# EAGLE design neuron (EAGLE 9.6.2)
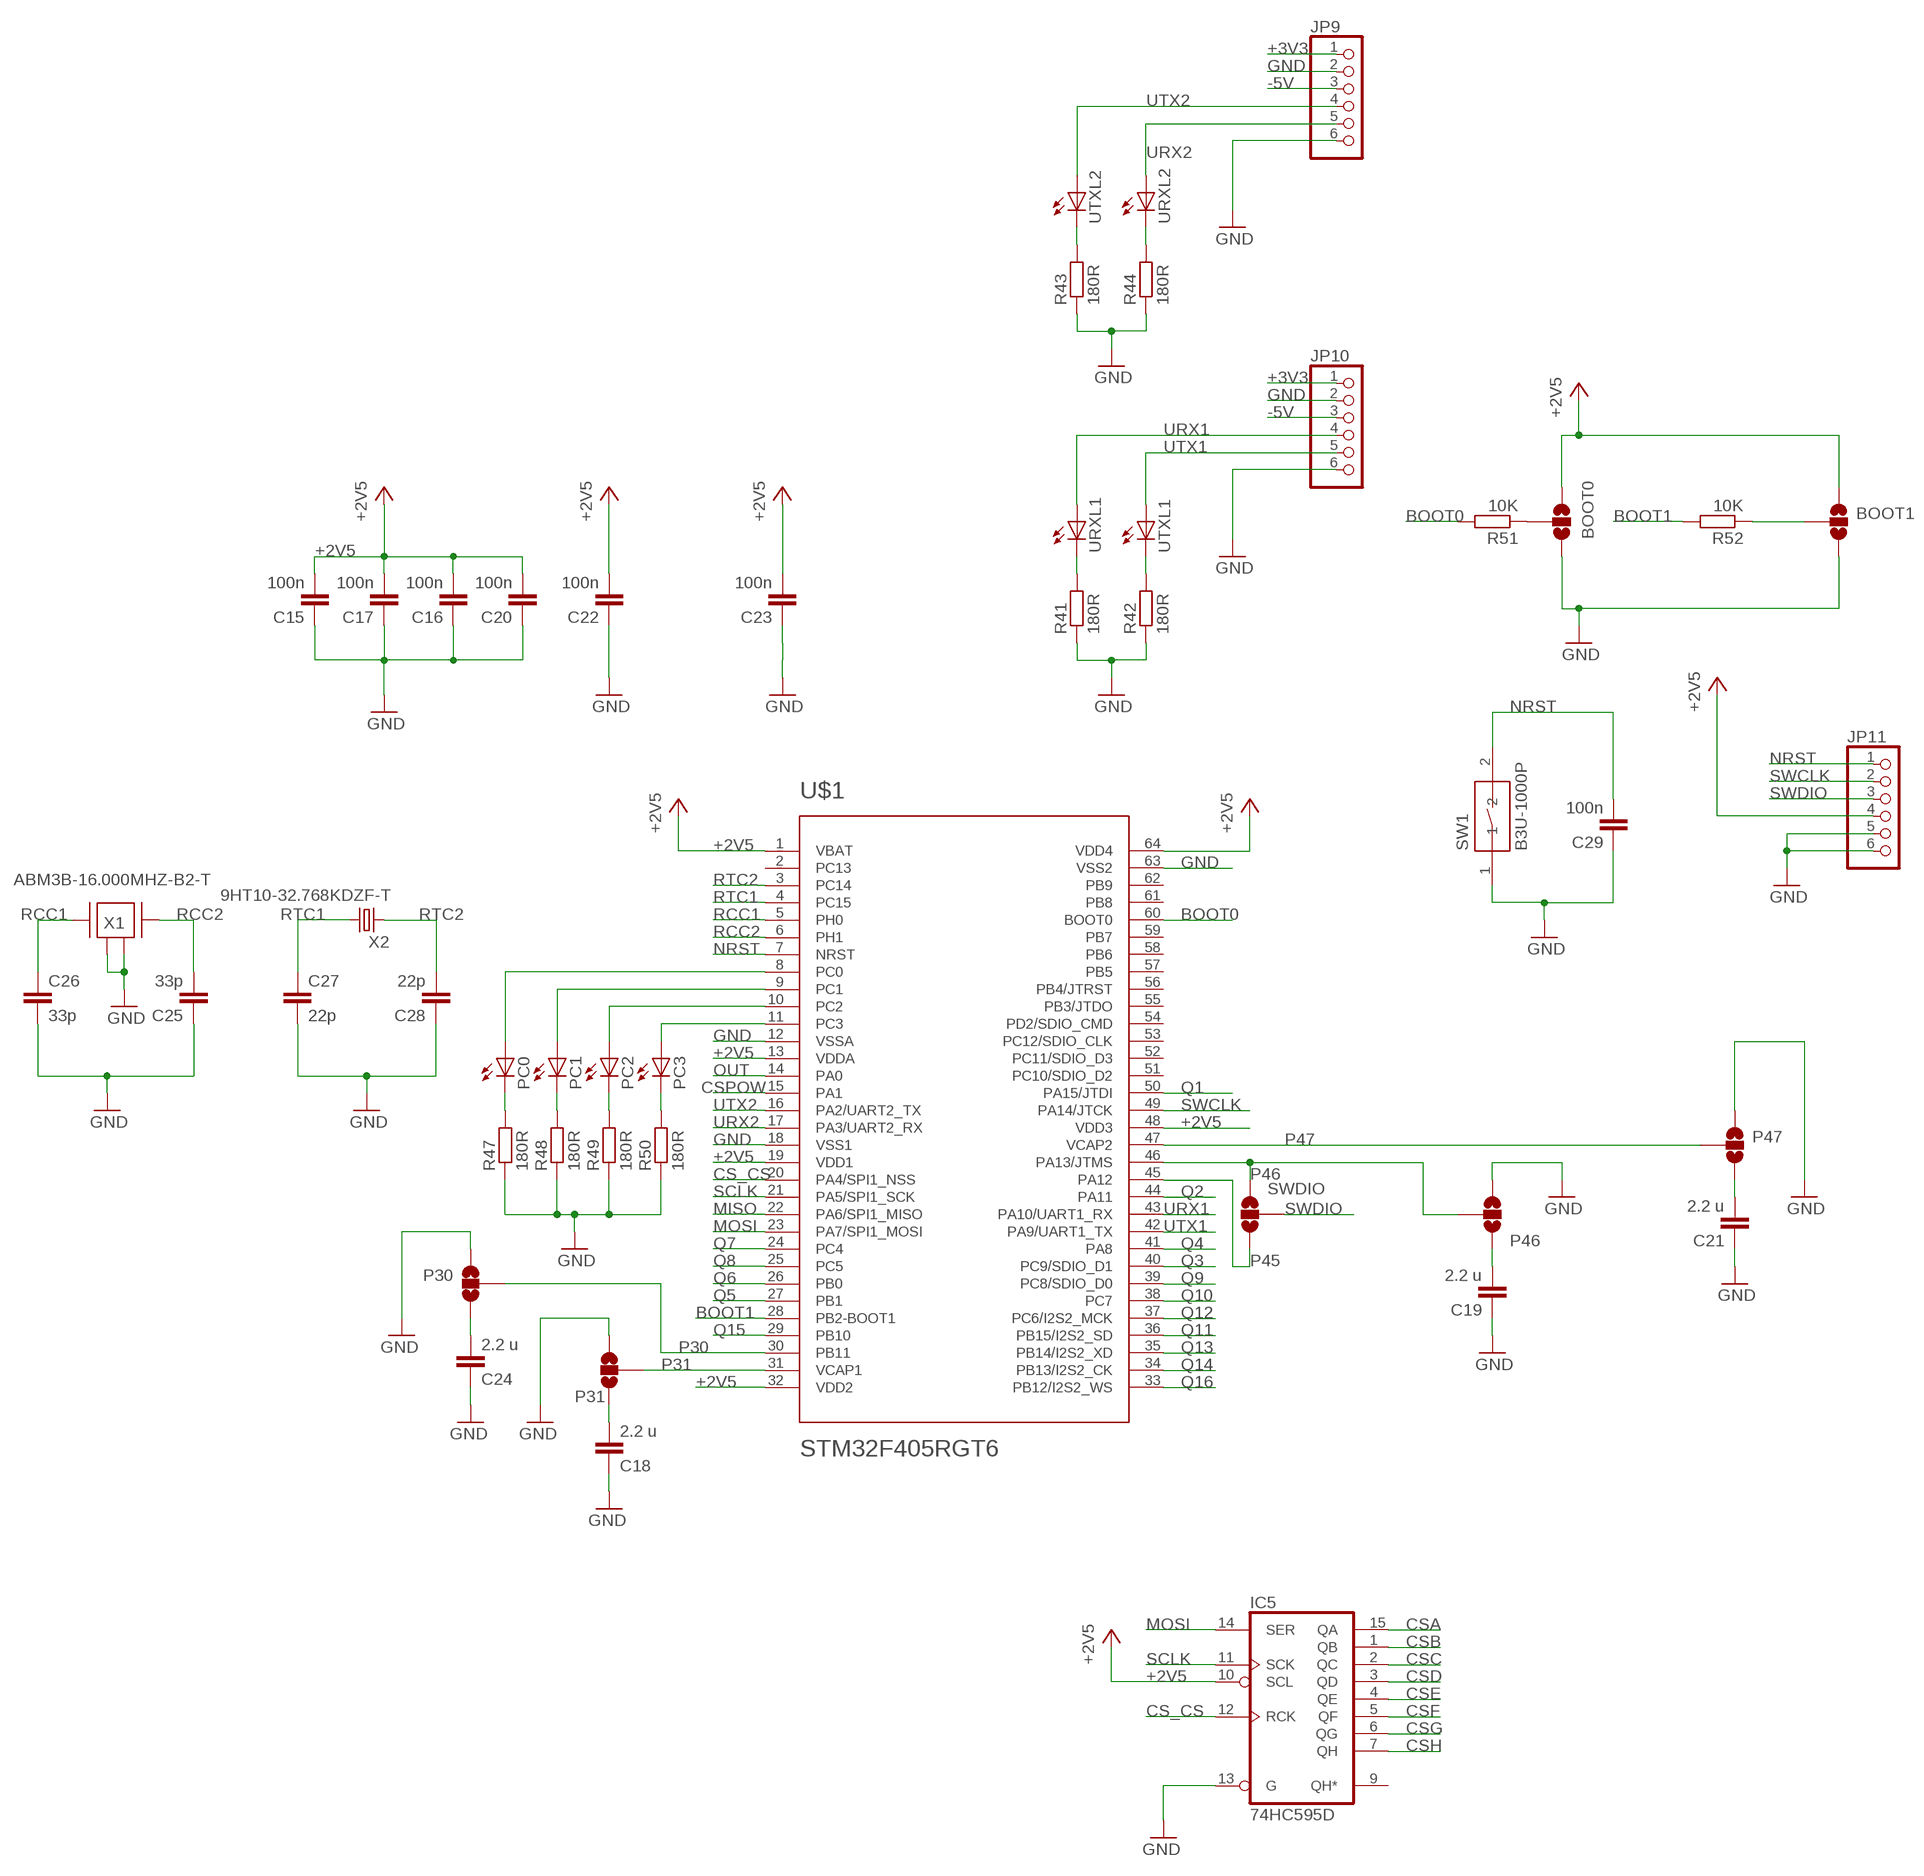
[diagram p0: schematic, sheet 1, part 1 of 2]
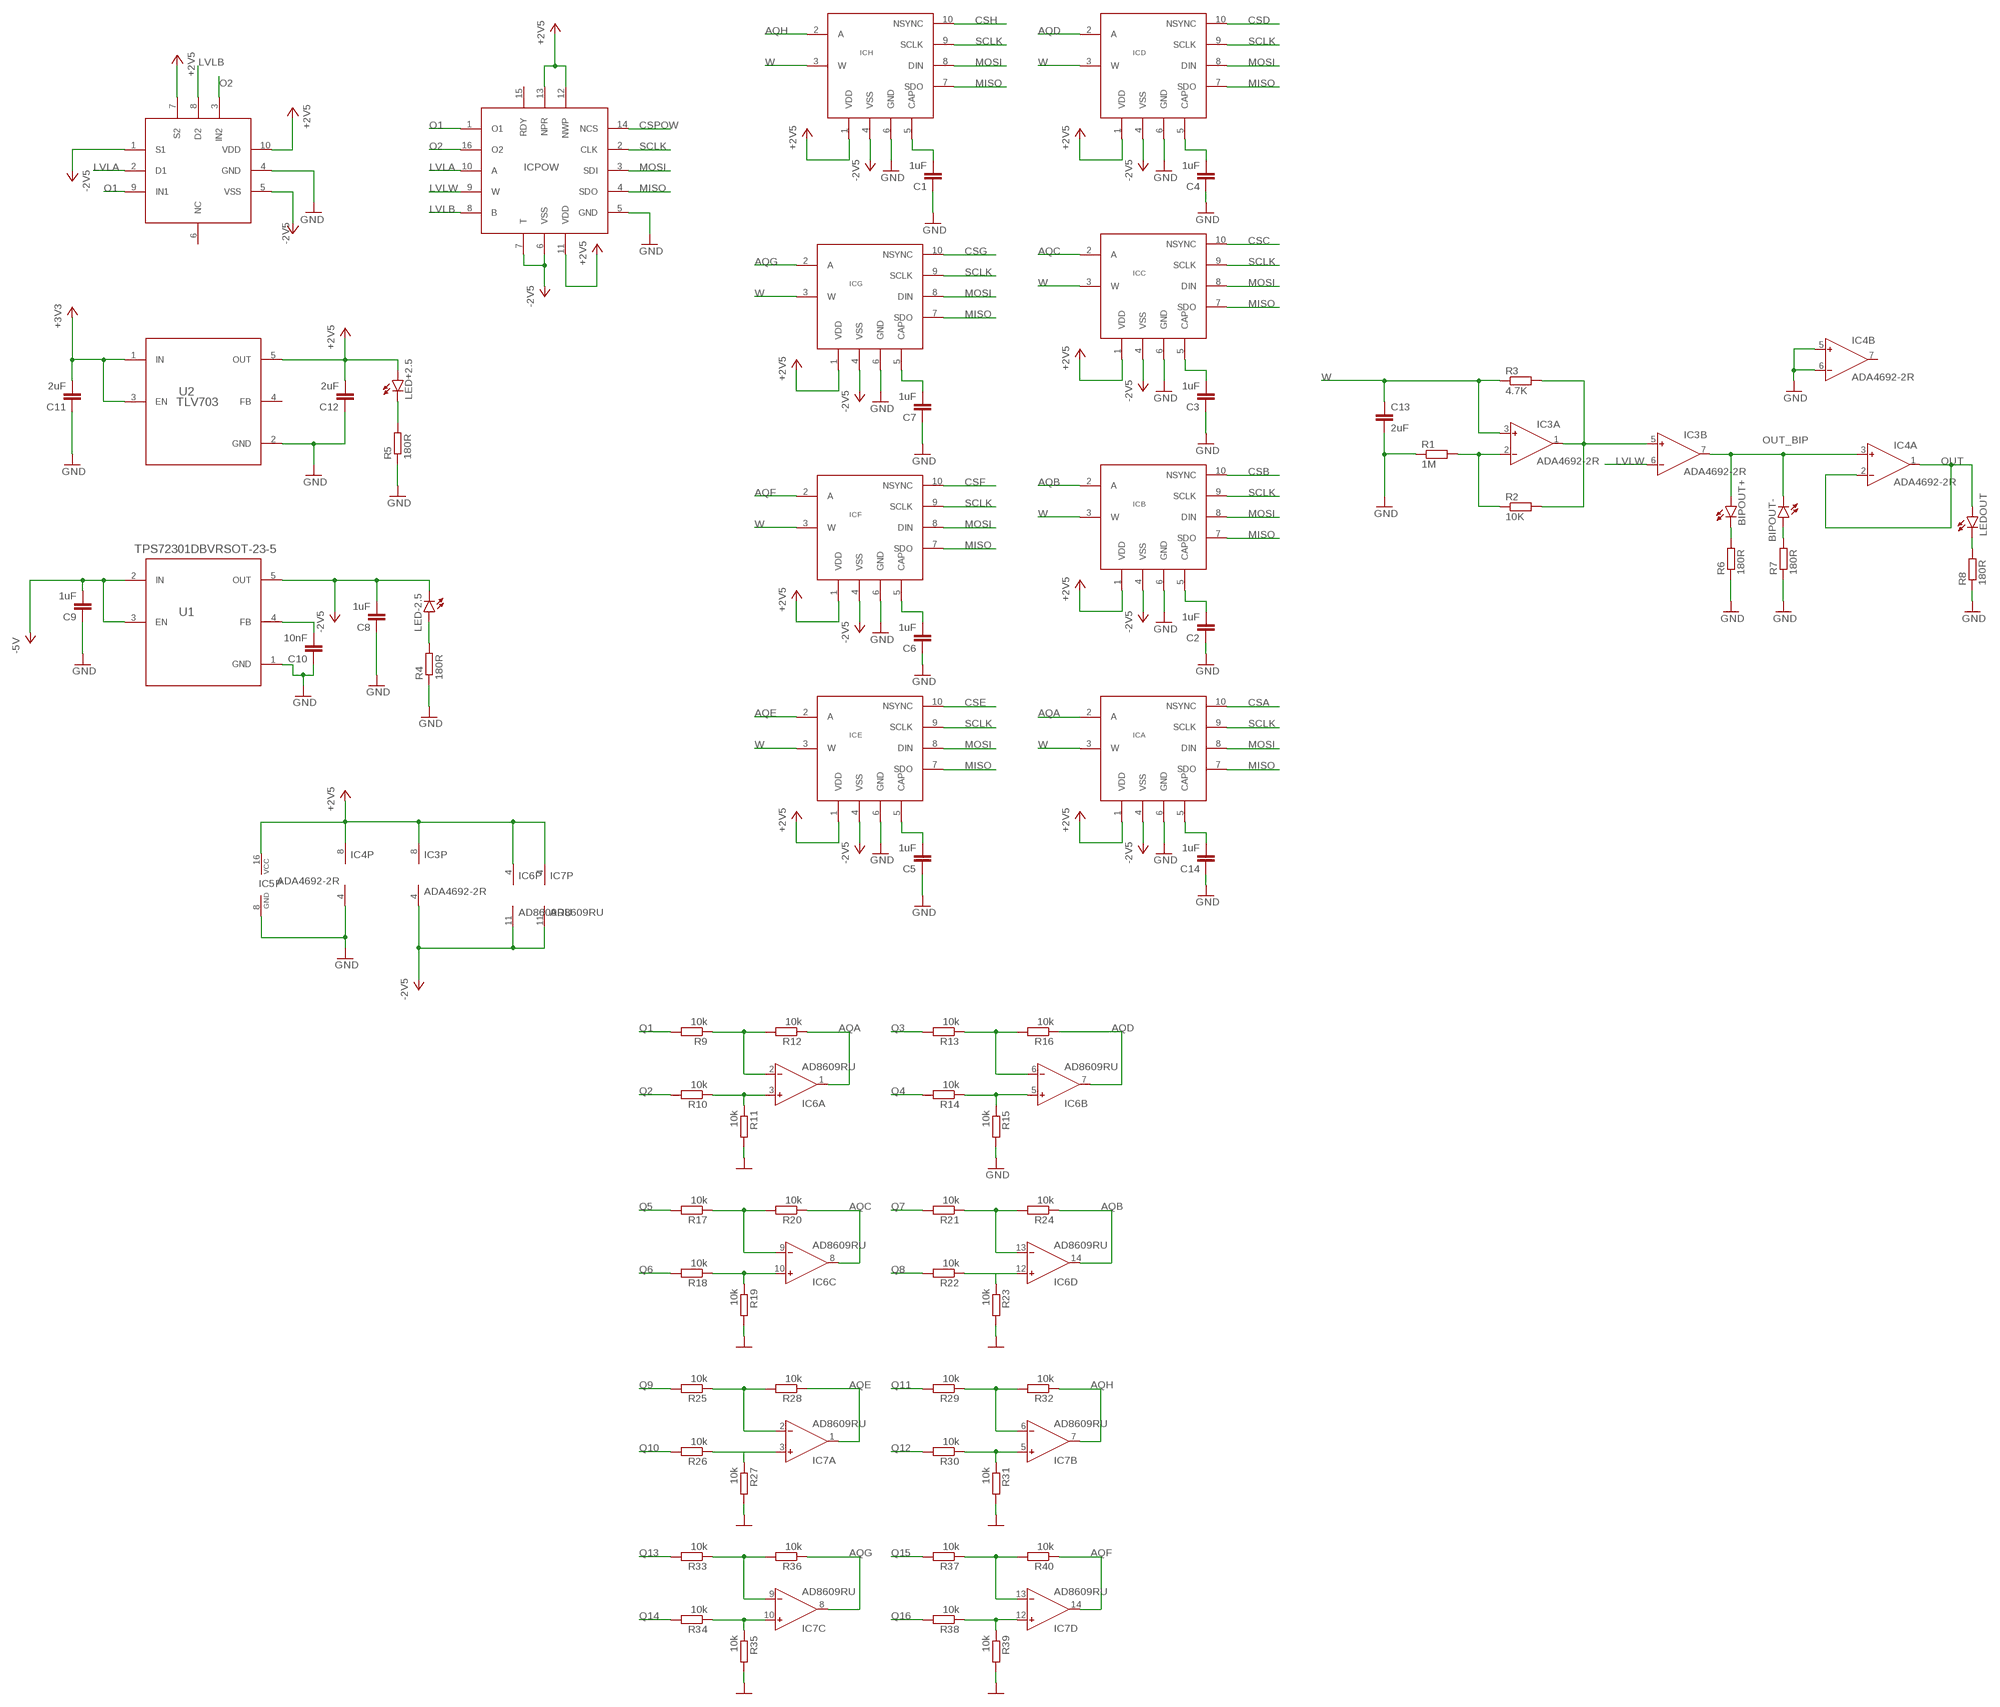
[diagram p1: schematic, sheet 1, part 2 of 2]

## Parts
BIPOUT+  LEDCHIPLED_0805  [CHIPLED_0805]
BIPOUT-  LEDCHIPLED_0805  [CHIPLED_0805]
BOOT0  JUMPER-SMT_3_NO_NO-SILK  [SMT-JUMPER_3_NO_NO-SILK]
BOOT1  JUMPER-SMT_3_NO_NO-SILK  [SMT-JUMPER_3_NO_NO-SILK]
C1  1uF  C-EUC0603  [C0603]
C2  1uF  C-EUC0603  [C0603]
C3  1uF  C-EUC0603  [C0603]
C4  1uF  C-EUC0603  [C0603]
C5  1uF  C-EUC0603  [C0603]
C6  1uF  C-EUC0603  [C0603]
C7  1uF  C-EUC0603  [C0603]
C8  1uF  C-EUC0603  [C0603]
C9  1uF  C-EUC0603  [C0603]
C10  10nF  C-EUC0603  [C0603]
C11  2uF  C-EUC0603  [C0603]
C12  2uF  C-EUC0603  [C0603]
C13  2uF  C-EUC0603K  [C0603K]
C14  1uF  C-EUC0603  [C0603]
C15  100n  C-EUC0603K  [C0603K]
C16  100n  C-EUC0603K  [C0603K]
C17  100n  C-EUC0603K  [C0603K]
C18  2.2 u  C-EUC0603K  [C0603K]
C19  2.2 u  C-EUC0603K  [C0603K]
C20  100n  C-EUC0603K  [C0603K]
C21  2.2 u  C-EUC0603K  [C0603K]
C22  100n  C-EUC0603K  [C0603K]
C23  100n  C-EUC0603K  [C0603K]
C24  2.2 u  C-EUC0603K  [C0603K]
C25  33p  C-EUC0603K  [C0603K]
C26  33p  C-EUC0603K  [C0603K]
C27  22p  C-EUC0603K  [C0603K]
C28  22p  C-EUC0603K  [C0603K]
C29  100n  C-EUC0603K  [C0603K]
IC3  ADA4692-2R  [SO8]
IC4  ADA4692-2R  [SO8]
IC5  74HC595D  [SO16]
IC6  AD8609RU  [TSSOP14]
IC7  AD8609RU  [TSSOP14]
ICA  AD5270MSOP10  [MSOP10]
ICB  AD5270MSOP10  [MSOP10]
ICC  AD5270MSOP10  [MSOP10]
ICD  AD5270MSOP10  [MSOP10]
ICE  AD5270MSOP10  [MSOP10]
ICF  AD5270MSOP10  [MSOP10]
ICG  AD5270MSOP10  [MSOP10]
ICH  AD5270MSOP10  [MSOP10]
ICPOW  AD5231  [TSSOP16]
ICSW  ADG621  [MSOP10]
JP9  PINHD-1X6  [1X06]
JP10  PINHD-1X6  [1X06]
JP11  PINHD-1X6  [1X06]
LED+2.5  LEDCHIPLED_0805  [CHIPLED_0805]
LED-2.5  LEDCHIPLED_0805  [CHIPLED_0805]
LEDOUT  LEDCHIPLED_0805  [CHIPLED_0805]
P30  JUMPER-SMT_3_NO_NO-SILK  [SMT-JUMPER_3_NO_NO-SILK]
P31  JUMPER-SMT_3_NO_NO-SILK  [SMT-JUMPER_3_NO_NO-SILK]
P46  JUMPER-SMT_3_NO_NO-SILK  [SMT-JUMPER_3_NO_NO-SILK]
P47  JUMPER-SMT_3_NO_NO-SILK  [SMT-JUMPER_3_NO_NO-SILK]
PC0  LEDCHIPLED_0805  [CHIPLED_0805]
PC1  LEDCHIPLED_0805  [CHIPLED_0805]
PC2  LEDCHIPLED_0805  [CHIPLED_0805]
PC3  LEDCHIPLED_0805  [CHIPLED_0805]
R1  1M  R-EU_R0603  [R0603]
R2  10K  R-EU_R0603  [R0603]
R3  4.7K  R-EU_R0603  [R0603]
R4  180R  R-EU_R0603  [R0603]
R5  180R  R-EU_R0603  [R0603]
R6  180R  R-EU_R0603  [R0603]
R7  180R  R-EU_R0603  [R0603]
R8  180R  R-EU_R0603  [R0603]
R9  10k  R-EU_R0603  [R0603]
R10  10k  R-EU_R0603  [R0603]
R11  10k  R-EU_R0603  [R0603]
R12  10k  R-EU_R0603  [R0603]
R13  10k  R-EU_R0603  [R0603]
R14  10k  R-EU_R0603  [R0603]
R15  10k  R-EU_R0603  [R0603]
R16  10k  R-EU_R0603  [R0603]
R17  10k  R-EU_R0603  [R0603]
R18  10k  R-EU_R0603  [R0603]
R19  10k  R-EU_R0603  [R0603]
R20  10k  R-EU_R0603  [R0603]
R21  10k  R-EU_R0603  [R0603]
R22  10k  R-EU_R0603  [R0603]
R23  10k  R-EU_R0603  [R0603]
R24  10k  R-EU_R0603  [R0603]
R25  10k  R-EU_R0603  [R0603]
R26  10k  R-EU_R0603  [R0603]
R27  10k  R-EU_R0603  [R0603]
R28  10k  R-EU_R0603  [R0603]
R29  10k  R-EU_R0603  [R0603]
R30  10k  R-EU_R0603  [R0603]
R31  10k  R-EU_R0603  [R0603]
R32  10k  R-EU_R0603  [R0603]
R33  10k  R-EU_R0603  [R0603]
R34  10k  R-EU_R0603  [R0603]
R35  10k  R-EU_R0603  [R0603]
R36  10k  R-EU_R0603  [R0603]
R37  10k  R-EU_R0603  [R0603]
R38  10k  R-EU_R0603  [R0603]
R39  10k  R-EU_R0603  [R0603]
R40  10k  R-EU_R0603  [R0603]
R41  180R  R-EU_R0603  [R0603]
R42  180R  R-EU_R0603  [R0603]
R43  180R  R-EU_R0603  [R0603]
R44  180R  R-EU_R0603  [R0603]
R47  180R  R-EU_R0603  [R0603]
R48  180R  R-EU_R0603  [R0603]
R49  180R  R-EU_R0603  [R0603]
R50  180R  R-EU_R0603  [R0603]
R51  10K  R-EU_R0603  [R0603]
R52  10K  R-EU_R0603  [R0603]
SW1  B3U-1000P  [B3U-1000P]
SWDIO  JUMPER-SMT_3_NO_NO-SILK  [SMT-JUMPER_3_NO_NO-SILK]
U1  TPS72301DBVRSOT-23-5  [SOT95P280X145-5N]
U2  TLV703  [SOT95P280X145-5N]
U$1  STM32F405RGT6  STM32F405RG  [TQFP64]
URXL1  LEDCHIPLED_0805  [CHIPLED_0805]
URXL2  LEDCHIPLED_0805  [CHIPLED_0805]
UTXL1  LEDCHIPLED_0805  [CHIPLED_0805]
UTXL2  LEDCHIPLED_0805  [CHIPLED_0805]
X1  ABM3B-16.000MHZ-B2-T  [ABM3B-16.000MHZ-B2-T]
X2  9HT10-32.768KDZF-T  [9HT10-32.768KDZF-T]

## Nets
+2V5: BOOT0.1 BOOT1.1 C12.2 C15.2 C16.2 C17.2 C20.2 C22.2 C23.2 IC3.8(P:V+) IC4.8(P:V+) IC5.10(SCL) IC5.16(VCC) IC6.4(P:V+) IC7.4(P:V+) ICA.1(VDD) ICB.1(VDD) ICC.1(VDD) ICD.1(VDD) ICE.1(VDD) ICF.1(VDD) ICG.1(VDD) ICH.1(VDD) ICPOW.11(VDD) ICPOW.12(NWP) ICPOW.13(NPR) ICSW.7(S2) ICSW.10(VDD) JP11.4 LED+2.5.A U2.5(OUT) U$1.1(VBAT) U$1.13(VDDA) U$1.19(VDD1) U$1.32(VDD2) U$1.48(VDD3) U$1.64(VDD4)
+3V3: C11.2 JP9.1 JP10.1 U2.1(IN) U2.3(EN)
-2V5: C8.2 IC3.4(P:V-) IC6.11(P:V-) IC7.11(P:V-) ICA.4(VSS) ICB.4(VSS) ICC.4(VSS) ICD.4(VSS) ICE.4(VSS) ICF.4(VSS) ICG.4(VSS) ICH.4(VSS) ICPOW.6(VSS) ICPOW.7(T) ICSW.1(S1) ICSW.5(VSS) LED-2.5.C U1.5(OUT)
-5V: C9.2 JP9.3 JP10.3 U1.2(IN) U1.3(EN)
AQA: IC6.1(A:OUT) ICA.2(A) R12.1
AQB: IC6.14(D:OUT) ICB.2(A) R24.1
AQC: IC6.8(C:OUT) ICC.2(A) R20.1
AQD: IC6.7(B:OUT) ICD.2(A) R16.1
AQE: IC7.1(A:OUT) ICE.2(A) R28.1
AQF: IC7.14(D:OUT) ICF.2(A) R40.1
AQG: IC7.8(C:OUT) ICG.2(A) R36.1
AQH: IC7.7(B:OUT) ICH.2(A) R32.1
BOOT0: R51.2 U$1.60(BOOT0)
BOOT1: R52.2 U$1.28(PB2-BOOT1)
CS_CS: IC5.12(RCK) U$1.20(PA4/SPI1_NSS)
CSA: IC5.15(QA) ICA.10(NSYNC)
CSB: IC5.1(QB) ICB.10(NSYNC)
CSC: IC5.2(QC) ICC.10(NSYNC)
CSD: IC5.3(QD) ICD.10(NSYNC)
CSE: IC5.4(QE) ICE.10(NSYNC)
CSF: IC5.5(QF) ICF.10(NSYNC)
CSG: IC5.6(QG) ICG.10(NSYNC)
CSH: IC5.7(QH) ICH.10(NSYNC)
CSPOW: ICPOW.14(NCS) U$1.15(PA1)
GND: BOOT0.3 BOOT1.3 C1.1 C2.1 C3.1 C4.1 C5.1 C6.1 C7.1 C8.1 C9.1 C10.1 C11.1 C12.1 C13.2 C14.1 C15.1 C16.1 C17.1 C18.1 C19.1 C20.1 C21.1 C22.1 C23.1 C24.1 C25.1 C26.2 C27.2 C28.1 C29.1 IC4.4(P:V-) IC4.5(B:IN+) IC4.6(B:IN-) IC5.8(GND) IC5.13(G) ICA.6(GND) ICB.6(GND) ICC.6(GND) ICD.6(GND) ICE.6(GND) ICF.6(GND) ICG.6(GND) ICH.6(GND) ICPOW.5(GND) ICSW.4(GND) JP9.2 JP9.6 JP10.2 JP10.6 JP11.5 JP11.6 P30.1 P31.1 P46.1 P47.1 R1.1 R4.1 R5.1 R6.1 R7.1 R8.1 R11.2 R15.2 R19.2 R23.2 R27.2 R31.2 R35.2 R39.2 R41.1 R42.1 R43.1 R44.1 R47.1 R48.1 R49.1 R50.1 SW1.1 U1.1(GND) U2.2(GND) U$1.12(VSSA) U$1.18(VSS1) U$1.63(VSS2) X1.2 X1.4
LVLA: ICPOW.10(A) ICSW.2(D1)
LVLB: ICPOW.8(B) ICSW.8(D2)
LVLW: IC3.6(B:IN-) ICPOW.9(W)
MISO: ICA.7(SDO) ICB.7(SDO) ICC.7(SDO) ICD.7(SDO) ICE.7(SDO) ICF.7(SDO) ICG.7(SDO) ICH.7(SDO) ICPOW.4(SDO) U$1.22(PA6/SPI1_MISO)
MOSI: IC5.14(SER) ICA.8(DIN) ICB.8(DIN) ICC.8(DIN) ICD.8(DIN) ICE.8(DIN) ICF.8(DIN) ICG.8(DIN) ICH.8(DIN) ICPOW.3(SDI) U$1.23(PA7/SPI1_MOSI)
N$1: C10.2 U1.4(FB)
N$2: IC3.1(A:OUT) IC3.5(B:IN+) R2.2 R3.2
N$3: C2.2 ICB.5(CAP)
N$4: LED-2.5.A R4.2
N$5: C1.2 ICH.5(CAP)
N$6: IC3.2(A:IN-) R1.2 R2.1
N$7: LED+2.5.C R5.2
N$8: C3.2 ICC.5(CAP)
N$9: BIPOUT+.C R6.2
N$10: BIPOUT-.A R7.2
N$11: C4.2 ICD.5(CAP)
N$12: LEDOUT.C R8.2
N$13: C14.2 ICA.5(CAP)
N$14: C5.2 ICE.5(CAP)
N$15: IC6.3(A:IN+) R10.1 R11.1
N$16: IC6.6(B:IN-) R13.1 R16.2
N$17: C6.2 ICF.5(CAP)
N$18: IC6.10(C:IN+) R18.1 R19.1
N$19: IC6.9(C:IN-) R17.1 R20.2
N$20: C7.2 ICG.5(CAP)
N$21: IC6.2(A:IN-) R9.1 R12.2
N$22: IC6.12(D:IN+) R22.1 R23.1
N$23: IC6.13(D:IN-) R21.1 R24.2
N$24: IC7.3(A:IN+) R26.1 R27.1
N$25: IC7.12(D:IN+) R38.1 R39.1
N$26: IC6.5(B:IN+) R14.1 R15.1
N$28: IC7.6(B:IN-) R29.1 R32.2
N$29: IC7.10(C:IN+) R34.1 R35.1
N$30: IC7.9(C:IN-) R33.1 R36.2
N$31: BOOT0.2 R51.1
N$32: IC7.13(D:IN-) R37.1 R40.2
N$33: IC7.5(B:IN+) R30.1 R31.1
N$34: R43.2 UTXL2.C
N$35: R44.2 URXL2.C
N$36: C21.2 P47.3
N$38: C18.2 P31.3
N$41: R41.2 URXL1.C
N$42: R42.2 UTXL1.C
N$43: IC7.2(A:IN-) R25.1 R28.2
N$47: PC0.C R47.2
N$48: PC1.C R48.2
N$49: PC2.C R49.2
N$50: PC3.C R50.2
N$51: C19.2 P46.3
N$52: BOOT1.2 R52.1
N$55: C24.2 P30.3
N$56: PC3.A U$1.11(PC3)
N$57: PC2.A U$1.10(PC2)
N$58: PC1.A U$1.9(PC1)
N$59: PC0.A U$1.8(PC0)
NRST: C29.2 JP11.1 SW1.2 U$1.7(NRST)
O1: ICPOW.1(O1) ICSW.9(IN1)
O2: ICPOW.16(O2) ICSW.3(IN2)
OUT: IC4.1(A:OUT) IC4.2(A:IN-) LEDOUT.A U$1.14(PA0)
OUT_BIP: BIPOUT+.A BIPOUT-.C IC3.7(B:OUT) IC4.3(A:IN+)
P30: P30.2 U$1.30(PB11)
P31: P31.2 U$1.31(VCAP1)
P45: SWDIO.1 U$1.45(PA12)
P46: P46.2 SWDIO.3 U$1.46(PA13/JTMS)
P47: P47.2 U$1.47(VCAP2)
Q1: R9.2 U$1.50(PA15/JTDI)
Q2: R10.2 U$1.44(PA11)
Q3: R13.2 U$1.40(PC9/SDIO_D1)
Q4: R14.2 U$1.41(PA8)
Q5: R17.2 U$1.27(PB1)
Q6: R18.2 U$1.26(PB0)
Q7: R21.2 U$1.24(PC4)
Q8: R22.2 U$1.25(PC5)
Q9: R25.2 U$1.39(PC8/SDIO_D0)
Q10: R26.2 U$1.38(PC7)
Q11: R29.2 U$1.36(PB15/I2S2_SD)
Q12: R30.2 U$1.37(PC6/I2S2_MCK)
Q13: R33.2 U$1.35(PB14/I2S2_XD)
Q14: R34.2 U$1.34(PB13/I2S2_CK)
Q15: R37.2 U$1.29(PB10)
Q16: R38.2 U$1.33(PB12/I2S2_WS)
RCC1: C26.1 U$1.5(PH0) X1.1
RCC2: C25.2 U$1.6(PH1) X1.3
RTC1: C27.1 U$1.4(PC15) X2.2
RTC2: C28.2 U$1.3(PC14) X2.1
SCLK: IC5.11(SCK) ICA.9(SCLK) ICB.9(SCLK) ICC.9(SCLK) ICD.9(SCLK) ICE.9(SCLK) ICF.9(SCLK) ICG.9(SCLK) ICH.9(SCLK) ICPOW.2(CLK) U$1.21(PA5/SPI1_SCK)
SWCLK: JP11.2 U$1.49(PA14/JTCK)
SWDIO: JP11.3 SWDIO.2
URX1: JP10.4 U$1.43(PA10/UART1_RX) URXL1.A
URX2: JP9.5 U$1.17(PA3/UART2_RX) URXL2.A
UTX1: JP10.5 U$1.42(PA9/UART1_TX) UTXL1.A
UTX2: JP9.4 U$1.16(PA2/UART2_TX) UTXL2.A
W: C13.1 IC3.3(A:IN+) ICA.3(W) ICB.3(W) ICC.3(W) ICD.3(W) ICE.3(W) ICF.3(W) ICG.3(W) ICH.3(W) R3.1
Unconnected: IC4.7(B:OUT) IC5.9(QH*) ICPOW.15(RDY) ICSW.6(NC) U2.4(FB) U$1.2(PC13) U$1.51(PC10/SDIO_D2) U$1.52(PC11/SDIO_D3) U$1.53(PC12/SDIO_CLK) U$1.54(PD2/SDIO_CMD) U$1.55(PB3/JTDO) U$1.56(PB4/JTRST) U$1.57(PB5) U$1.58(PB6) U$1.59(PB7) U$1.61(PB8) U$1.62(PB9)

## Library data of the parts
BIPOUT+ BIPOUT- LED+2.5 LED-2.5 LEDOUT = led:LED: LED OSRAM: - CHIPLED LG R971, LG N971, LY N971, LG Q971, LY Q971, LO R971, LY R971 LH N974, LH R974 LS Q976, LO Q976, LY Q976 LO Q996 - Hyper CHIPLED LW Q18S LB Q993, LB Q99A, LB R99A - SideLED LS A670, LO A670, LY A670, LG A670, LP A670 LB A673, LV A673, LT A673, LW A673 LH A674 LY A675 LS A676, LA A676, LO A676, LY A676, LW A676 LS A679, LY A679, LG A679 - Hyper Micro SIDELED® LS Y876, LA Y876, LO Y876, LY Y876 LT Y87S - SmartLED LW L88C, LW L88S LB L89C, LB L89S, LG L890 LS L89K, LO L89K, LY L89K LS L896, LA L896, LO L896, LY L896 - TOPLED LS T670, LO T670, LY T670, LG T670, LP T670 LSG T670, LSP T670, LSY T670, LOP T670, LYG T670 LG T671, LOG T671, LSG T671 LB T673, LV T673, LT T673, LW T673 LH T674 LS T676, LA T676, LO T676, LY T676, LB T676, LH T676, LSB T676, LW T676 LB T67C, LV T67C, LT T67C, LS T67K, LO T67K, LY T67K, LW E67C LS E67B, LA E67B, LO E67B, LY E67B, LB E67C, LV E67C, LT E67C LW T67C LS T679, LY T679, LG T679 LS T770, LO T770, LY T770, LG T770, LP T770 LB T773, LV T773, LT T773, LW T773 LH T774 LS E675, LA E675, LY E675, LS T675 LS T776, LA T776, LO T776, LY T776, LB T776 LHGB T686 LT T68C, LB T68C - Hyper Mini TOPLED® LB M676 - Mini TOPLED Santana® LG M470 LS M47K, LO M47K, LY M47K Source: http://www.osram.convergy.de LUXEON: - LUMILED® LXK2-PW12-R00, LXK2-PW12-S00, LXK2-PW14-U00, LXK2-PW14-V00 LXK2-PM12-R00, LXK2-PM12-S00, LXK2-PM14-U00 LXK2-PE12-Q00, LXK2-PE12-R00, LXK2-PE12-S00, LXK2-PE14-T00, LXK2-PE14-U00 LXK2-PB12-K00, LXK2-PB12-L00, LXK2-PB12-M00, LXK2-PB14-N00, LXK2-PB14-P00, LXK2-PB14-Q00 LXK2-PR12-L00, LXK2-PR12-M00, LXK2-PR14-Q00, LXK2-PR14-R00 LXK2-PD12-Q00, LXK2-PD12-R00, LXK2-PD12-S00 LXK2-PH12-R00, LXK2-PH12-S00 LXK2-PL12-P00, LXK2-PL12-Q00, LXK2-PL12-R00 Source: www.luxeon.com KINGBRIGHT: KA-3528ASYC Source: www.kingbright.com
BOOT0 BOOT1 P30 P31 P46 P47 SWDIO = SparkFun-Jumpers_custom:JUMPER-SMT_3_NO: Normally open jumper This jumper has three pads in close proximity to each other. Apply solder to close the connection(s).
C1-C29 = rcl:C-EU: CAPACITOR, European symbol; SPICEPREFIX: C
IC3 IC4 = analog-devices:ADA4692-2: Low Power, 3.6 MHz, Low Noise, Rail-to-Rail Output, Operational Amplifiers Source: http://www.analog.com/static/imported-files/data_sheets/ADA4691-2_4692-2_4692-4.pdf; MPN: ADA4692-2ARZ; OC_FARNELL: 1760810; OC_NEWARK: 05R6523
IC5 = 74xx-eu:74*595: 8-bit SHIFT REGISTER, output latch
IC6 IC7 = analog-devices:AD8609: Precision Micropower, Low Noise CMOS, Rail-to-Rail Input/Output Operational Amplifiers Source: http://www.analog.com/static/imported-files/data_sheets/AD8603_8607_8609.pdf; MF: ALTERA CORPORATION; MPN: AD8609ARUZ; OC_FARNELL: 1464994; OC_NEWARK: 59K6934
ICA ICB ICC ICD ICE ICF ICG ICH = untitled:AD5270
ICPOW = untitled:AD5231
ICSW = untitled:ADG621
JP9-JP11 = pinhead:PINHD-1X6: PIN HEADER
PC0 PC1-PC3 URXL1 URXL2 UTXL1 UTXL2 = audio amplifier example:LED
R1-R44 R47-R52 = rcl:R-EU_: RESISTOR, European symbol; SPICEPREFIX: R
SW1 = Switch:B3U-1000P: SWITCH TACTILE SPST-NO 0.05A 12V Manufacturer's datasheet <https://omronfs.omron.com/en_US/ecb/products/pdf/en-b3u.pdf>; CREATED_BY: PCBLayout.com; DIGI_KEY_PART_NUMBER: SW1020CT-ND; MANUFACTURER: Omron Electronics Inc-EMC Div; MPN: B3U-1000P; PACKAGE: SPST-NO
U1 = titled:TPS72301DBVR
U2 = titled:TLV703
U$1 = SparkFun-IC-Microcontroller:STM32F405RG: STM32F405RGT6 ARM DSP Chip used on the WAV Trigger board. IC MCU 32BIT 1MB FLASH 64LQFP Datasheet <https://cdn.sparkfun.com/datasheets/Widgets/STM32F405RGT6.pdf> SparkFun Products WAV Trigger <https://www.sparkfun.com/products/13660> (WIG-13660); PROD_ID: IC-11709
X1 = Crystals:ABM3B-16.000MHZ-B2-T: CRYSTAL 16.0000MHZ 18PF SMD Manufacturer's datasheet <https://abracon.com/Resonators/abm3b.pdf>; CREATED_BY: PCBLayout.com; DIGIKEY_PART_NUMBER: 535-9122-2-ND; MANUFACTURER: Abracon LLC; MPN: ABM3B-16.000MHZ-B2-T; PACKAGE: SMD 4
X2 = Crystals:9HT10-32.768KDZF-T: CRYSTAL 32.7680KHZ 12.5PF SMD Manufacturer's datasheet <http://www.txccrystal.com/images/pdf/9ht10.pdf>; CREATED_BY: PCBLayout.com; DIGIKEY_PART_NUMBER: 887-1504-2-ND; MANUFACTURER: TXC CORPORATION; MPN: 9HT10-32.768KDZF-T; PACKAGE: SMD

## Net classes
0 default: width 0.15 mm, drill 0.3 mm, clearance 0.205 mm

## Board
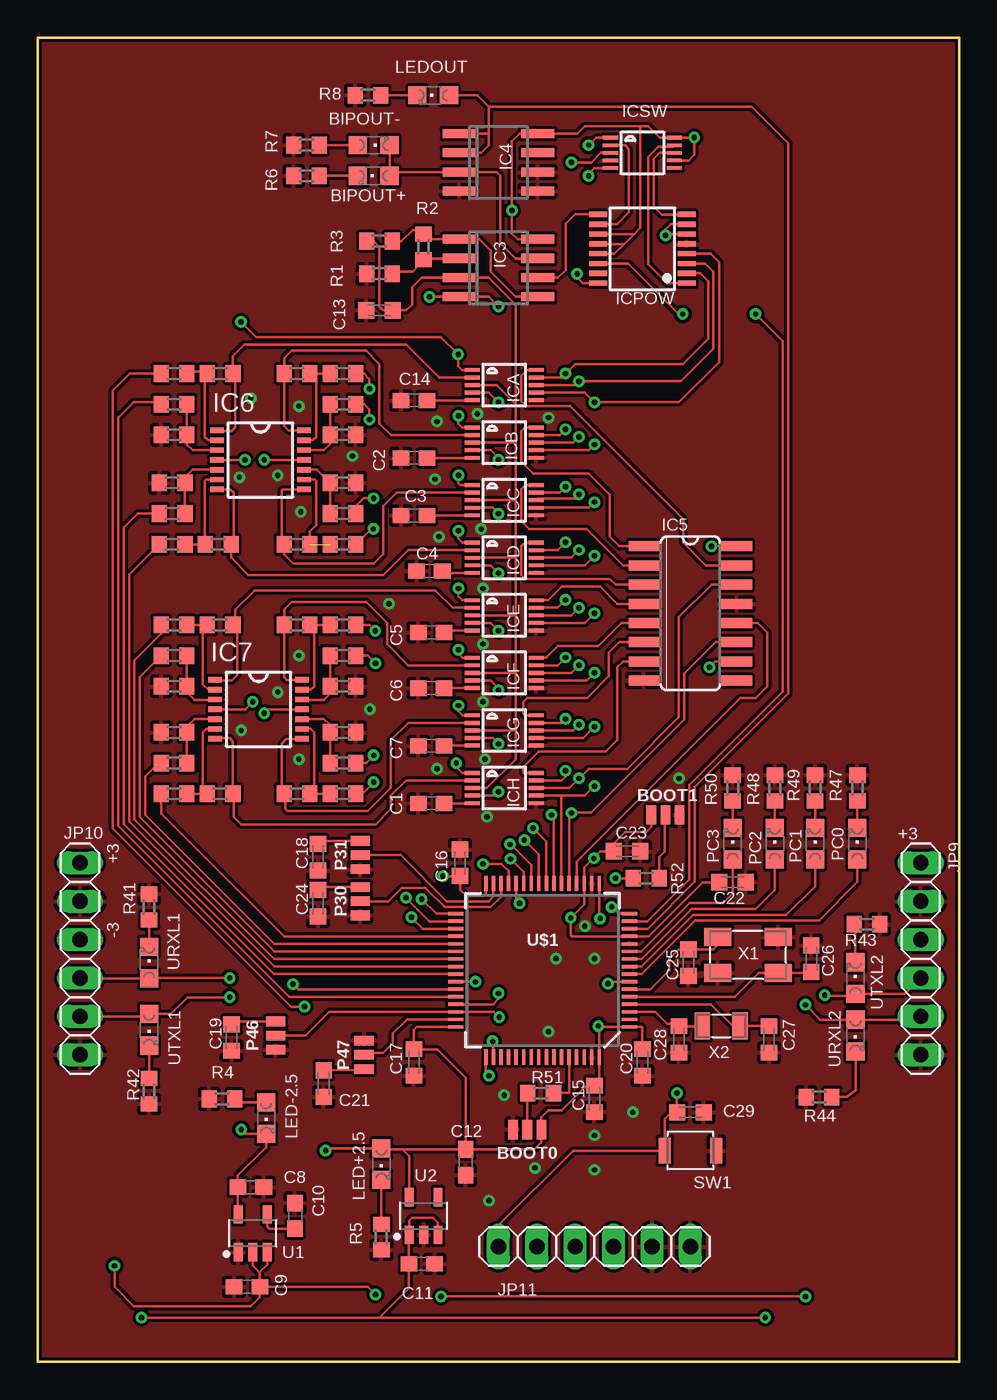
[diagram p2: board, top side]
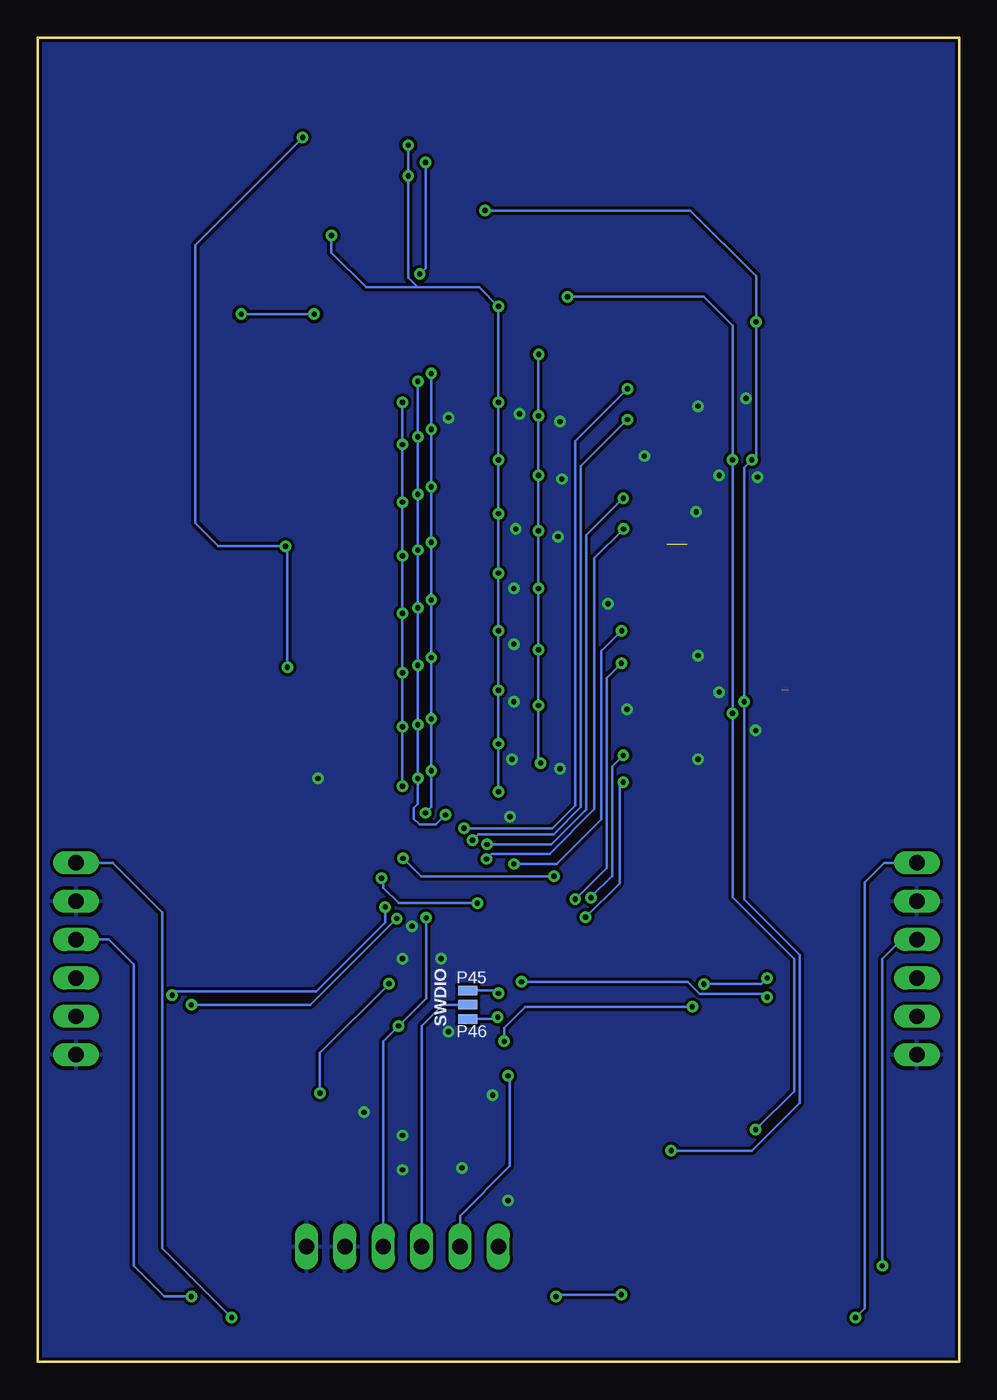
[diagram p3: board, bottom side, seen from below]

Size 60.96 x 87.63 mm. Coordinates in mm from the lower left corner, seen from the top.
Outline: 0,87.63 0,0 60.96,0 60.96,87.63 0,87.63
Copper layers (1*16): Top 0.018mm / dielectric 1.5mm / Bottom 0.018mm
Design rules "rezonit_minimal": minimum track width 5mil, minimum drill 12mil, track to track 5mil, track to pad 5mil, pad to pad 5mil, via to via 5mil, smd to smd 5mil, copper to edge 8mil, drill to drill 0.25mm, minimum pad ring 8mil, minimum via ring 8mil, stop-mask expansion 4mil, vias tented up to drill 0mil, thermal gap 10mil

### Footprints (pad centres in the part's own frame; a part is rotated, then mirrored left to right if it is on the bottom)
CHIPLED_0805 = smd 1.2 x 1.2: A 0,-1.05; C 0,1.05
SMT-JUMPER_3_NO_NO-SILK = smd 0.635 x 1.27: 1 -0.94,0; 2 0,0; 3 0.94,0
C0603 = smd 1.1 x 1: 1 -0.85,0; 2 0.85,0
C0603K = smd 1.05 x 1.08: 1 -0.875,0; 2 0.875,0
SO8 = smd 0.6 x 2.2: 1 -1.905,-2.6; 2 -0.635,-2.6; 3 0.635,-2.6; 4 1.905,-2.6; 5 1.905,2.6; 6 0.635,2.6; 7 -0.635,2.6; 8 -1.905,2.6
SO16 = smd 0.66 x 2.032: 1 -4.445,-3.073; 2 -3.175,-3.073; 3 -1.905,-3.073; 4 -0.635,-3.073; 5 0.635,-3.073; 6 1.905,-3.073; 7 3.175,-3.073; 8 4.445,-3.073; 9 4.445,3.073; 10 3.175,3.073; 11 1.905,3.073; 12 0.635,3.073; 13 -0.635,3.073; 14 -1.905,3.073; 15 -3.175,3.073; 16 -4.445,3.073
TSSOP14 = smd 0.9 x 0.35: 1 -2.875,1.95; 2 -2.875,1.3; 3 -2.875,0.65; 4 -2.875,0; 5 -2.875,-0.65; 6 -2.875,-1.3; 7 -2.875,-1.95; 8 2.875,-1.95; 9 2.875,-1.3; 10 2.875,-0.65; 11 2.875,0; 12 2.875,0.65; 13 2.875,1.3; 14 2.875,1.95
MSOP10 = smd 0.25 x 1: 1 -1,-2.113; 2 -0.5,-2.113; 3 0,-2.113; 4 0.5,-2.113; 5 1,-2.113; 6 1,2.113; 7 0.5,2.113; 8 0,2.113; 9 -0.5,2.113; 10 -1,2.113
TSSOP16 = smd 0.35 x 1.2: 1 -2.275,-2.925; 2 -1.625,-2.925; 3 -0.975,-2.925; 4 -0.325,-2.925; 5 0.325,-2.925; 6 0.975,-2.925; 7 1.625,-2.925; 8 2.275,-2.925; 9 2.275,2.925; 10 1.625,2.925; 11 0.975,2.925; 12 0.325,2.925; 13 -0.325,2.925; 14 -0.975,2.925; 15 -1.625,2.925; 16 -2.275,2.925
1X06 = drill 1.016 long: 1 -6.35,0; 2 -3.81,0; 3 -1.27,0; 4 1.27,0; 5 3.81,0; 6 6.35,0
R0603 = smd 1 x 1.1: 1 -0.85,0; 2 0.85,0
B3U-1000P = smd 0.8 x 1.7: 1 -1.7,0; 2 1.7,0
SOT95P280X145-5N = smd 1.209 x 0.589: 1 -1.253,0.95; 2 -1.253,0; 3 -1.253,-0.95; 4 1.253,-0.95; 5 1.253,0.95
TQFP64 = smd 0.22 x 1: 1 -3.75,-5.75; 2 -3.25,-5.75; 3 -2.75,-5.75; 4 -2.25,-5.75; 5 -1.75,-5.75; 6 -1.25,-5.75; 7 -0.75,-5.75; 8 -0.25,-5.75; 9 0.25,-5.75; 10 0.75,-5.75; 11 1.25,-5.75; 12 1.75,-5.75; 13 2.25,-5.75; 14 2.75,-5.75; 15 3.25,-5.75; 16 3.75,-5.75; 33 3.75,5.75; 34 3.25,5.75; 35 2.75,5.75; 36 2.25,5.75; 37 1.75,5.75; 38 1.25,5.75; 39 0.75,5.75; 40 0.25,5.75; 41 -0.25,5.75; 42 -0.75,5.75; 43 -1.25,5.75; 44 -1.75,5.75; 45 -2.25,5.75; 46 -2.75,5.75; 47 -3.25,5.75; 48 -3.75,5.75 | smd 1 x 0.22: 17 5.75,-3.75; 18 5.75,-3.25; 19 5.75,-2.75; 20 5.75,-2.25; 21 5.75,-1.75; 22 5.75,-1.25; 23 5.75,-0.75; 24 5.75,-0.25; 25 5.75,0.25; 26 5.75,0.75; 27 5.75,1.25; 28 5.75,1.75; 29 5.75,2.25; 30 5.75,2.75; 31 5.75,3.25; 32 5.75,3.75; 49 -5.75,3.75; 50 -5.75,3.25; 51 -5.75,2.75; 52 -5.75,2.25; 53 -5.75,1.75; 54 -5.75,1.25; 55 -5.75,0.75; 56 -5.75,0.25; 57 -5.75,-0.25; 58 -5.75,-0.75; 59 -5.75,-1.25; 60 -5.75,-1.75; 61 -5.75,-2.25; 62 -5.75,-2.75; 63 -5.75,-3.25; 64 -5.75,-3.75
ABM3B-16.000MHZ-B2-T = smd 1.8 x 1.2: 1 -2,1.2; 2 2,1.2; 3 2,-1.2; 4 -2,-1.2
9HT10-32.768KDZF-T = smd 1 x 1.8: 1 -1.25,0; 2 1.25,0

### Placement (x,y rotation side)
BIPOUT+  22.23,78.49 90 top
BIPOUT-  22.23,80.52 270 top
BOOT0  32.38,15.37 180 top
BOOT1  41.53,36.2 0 top
C1  26.04,36.96 0 top
C2  24.89,59.82 0 top
C3  24.89,56.01 0 top
C4  25.91,52.32 0 top
C5  26.04,48.26 0 top
C6  26.04,44.58 0 top
C7  26.04,40.77 0 top
C8  14.1,11.56 180 top
C9  13.84,4.95 0 top
C10  17.02,9.65 270 top
C11  25.4,6.48 180 top
C12  28.32,13.21 90 top
C13  22.61,69.6 180 top
C14  24.89,63.63 0 top
C15  36.83,17.4 90 top
C16  27.94,33.02 270 top
C17  24.89,19.81 90 top
C18  18.54,33.4 90 top
C19  12.83,21.46 90 top
C20  40.01,19.81 90 top
C21  18.92,18.41 90 top
C22  45.97,31.75 180 top
C23  38.99,33.78 180 top
C24  18.54,30.35 90 top
C25  43.05,26.42 90 top
C26  51.18,26.67 90 top
C27  48.39,21.34 270 top
C28  42.42,21.34 90 top
C29  43.18,16.51 180 top
IC3  30.48,72.39 270 top
IC4  30.48,79.38 270 top
IC5  43.18,49.53 270 top
IC6  14.73,59.69 0 top
IC7  14.61,43.18 0 top
ICA  30.86,64.64 270 top
ICB  30.86,60.83 270 top
ICC  30.86,57.02 270 top
ICD  30.86,53.21 270 top
ICE  30.86,49.4 270 top
ICF  30.86,45.59 270 top
ICG  30.86,41.78 270 top
ICH  30.86,37.97 270 top
ICPOW  40.01,73.66 90 top
ICSW  40.01,80.01 270 top
JP9  58.42,26.67 270 top
JP10  2.79,26.67 270 top
JP11  36.83,7.62 0 top
LED+2.5  22.73,13.08 180 top
LED-2.5  15.11,16.13 180 top
LEDOUT  26.16,83.82 90 top
P30  21.34,30.48 90 top
P31  21.34,33.53 90 top
P46  15.75,21.59 90 top
P47  21.59,20.32 270 top
PC0  54.23,34.29 0 top
PC1  51.44,34.29 0 top
PC2  48.77,34.29 0 top
PC3  45.97,34.29 0 top
R1  22.61,72.01 0 top
R2  25.53,73.79 90 top
R3  22.61,74.17 0 top
R4  12.19,17.4 0 top
R5  22.73,8.26 90 top
R6  17.78,78.49 0 top
R7  17.78,80.52 0 top
R8  21.84,83.82 0 top
R9  9.02,65.41 180 top
R10  9.02,63.37 180 top
R11  9.02,61.34 180 top
R12  12.06,65.41 180 top
R13  8.89,54.1 180 top
R14  8.89,56.13 180 top
R15  8.89,58.17 180 top
R16  11.94,54.1 180 top
R17  20.19,54.1 0 top
R18  20.19,56.13 0 top
R19  20.19,58.17 0 top
R20  17.14,54.1 0 top
R21  20.19,65.41 0 top
R22  20.19,63.37 0 top
R23  20.19,61.34 0 top
R24  17.14,65.41 0 top
R25  9.02,48.77 180 top
R26  9.02,46.74 180 top
R27  9.02,44.7 180 top
R28  12.06,48.77 180 top
R29  9.02,37.59 180 top
R30  9.02,39.62 180 top
R31  9.02,41.66 180 top
R32  12.06,37.59 180 top
R33  20.19,37.59 0 top
R34  20.19,39.62 0 top
R35  20.19,41.66 0 top
R36  17.14,37.59 0 top
R37  20.19,48.77 0 top
R38  20.19,46.74 0 top
R39  20.19,44.7 0 top
R40  17.14,48.77 0 top
R41  7.37,30.1 270 top
R42  7.37,17.91 90 top
R43  54.86,28.96 180 top
R44  51.69,17.53 0 top
R47  54.23,37.97 270 top
R48  51.44,37.97 270 top
R49  48.77,37.97 270 top
R50  45.97,37.97 270 top
R51  33.27,17.78 0 top
R52  40.26,32 180 top
SW1  43.18,13.97 180 top
SWDIO  32.51,23.62 270 bottom
U1  14.22,8.51 90 top
U2  25.53,9.65 90 top
U$1  33.4,25.91 90 top
URXL1  7.37,26.42 0 top
URXL2  54.1,21.59 180 top
UTXL1  7.37,21.97 180 top
UTXL2  54.1,25.4 0 top
X1  46.99,26.92 180 top
X2  45.21,22.23 0 top

### Tracks (layer width: path | path; a pad name or v marks a point on that pad's centre or on a via)
+2V5  (via drill 0.35)
  Top 0.152: v14.22,43.69 13.72,43.18 IC7.4 | IC3.8 31.75,74.3 31.37,74.68 v31.37,76.2 31.37,80.77 31.88,81.28 IC4.8 35.69,81.28 36.2,81.79 39.88,81.79 | 39.88,81.79 40.39,81.79 41.16,81.01 ICSW.10 42.13,81.03 v43.43,81.03 43.43,79.88 43.06,79.51 ICSW.7 | ICPOW.13 38.16,73.33 38.81,73.98 | 39.88,81.79 39.88,75.06 39.46,74.64 | 38.81,73.98 39.46,74.64 | ICPOW.12 38.81,73.98 | ICPOW.11 39.46,74.64 | C20.2 40.01,22.1 39.95,22.16 U$1.1 37.15,22.16 | C22.2 45.08,31.73 44,31.73 40.43,28.15 40.42,28.16 U$1.13 35.34,28.16 35.26,28.24 v35.26,29.38 36.15,30.27 U$1.19 36.15,32.72 36.74,33.32 v36.79,33.32 36.79,33.36 37.21,33.78 C23.2 38.11,34.3 38.86,35.05 40.26,35.05 40.59,35.38 BOOT1.1 | U$1.48 25.08,22.16 24.89,21.97 C17.2 26.43,20.69 28.32,18.8 C12.2 | 37.15,22.16 v37.08,22.23 | 37.15,22.16 U$1.64 37.15,18.66 36.83,18.34 | v27.69,39.62 27.69,39.37 28.08,38.97 ICH.1 | ICA.1 28.08,65.64 27.81,65.91 v27.81,66.67 26.67,67.82 14.45,67.82 v13.44,68.83 | ICB.1 28.08,61.83 27.81,62.1 27.81,62.59 v27.84,62.61 | ICC.1 27.96,58.02 27.81,58.17 27.81,58.65 v27.84,58.67 | ICD.1 28.08,54.21 27.81,54.48 27.81,54.97 v27.84,54.99 | ICE.1 28.08,50.4 27.81,50.67 27.81,51.16 v27.84,51.18 | ICG.1 28.11,42.78 27.84,43.05 v27.84,43.43 | ICF.1 28.11,46.59 27.84,46.86 v27.84,47.12 | C12.2 32.85,14.06 33.33,14.53 BOOT0.1 33.33,16.18 33.78,16.64 34.67,16.64 36.24,18.21 36.7,18.21 36.83,18.34 | U$1.32 29.65,31 29.46,30.81 28.37,30.81 27.94,31.24 C16.2 27.93,32.13 v26.8,32.13 | IC5.10 44.83,46.35 v44.45,45.97 | v44.58,53.98 IC5.16 | C15.2 36.89,18.34 36.83,18.34 | v19.05,13.97 19.21,14.13 LED+2.5.A 22.81,14.06 24.13,14.06
  Top 0.152: C12.2 24.13,14.06 | 24.13,14.06 24.58,13.61 U2.5 | IC6.4 v13.72,59.69
  Bottom 0.152: JP11.4 38.1,21.21 v37.08,22.23 35.26,24.05 v35.26,29.38 | v19.05,13.97 13.72,13.97 10.54,17.14 10.54,26.92 14.22,30.61 v14.22,43.69 14.22,59.18 v13.72,59.69 13.44,59.97 v13.44,68.83 13.44,71.86 17.78,76.2 v31.37,76.2 | v27.81,66.67 27.84,66.65 v27.84,62.61 v27.84,58.67 v27.84,54.99 v27.84,51.18 v27.84,47.12 v27.84,43.43 27.84,39.77 v27.69,39.62 | v26.8,32.13 35.6,32.13 v36.79,33.32 | v44.45,45.97 44.45,53.85 v44.58,53.98 49.02,53.98 50.55,55.5 50.55,73.91 v43.43,81.03
+3V3  (via drill 0.35)
  Top 0.152: U2.3 26.48,9.21 26.16,9.53 24.77,9.53 24.58,9.34 U2.1 24.55,8.37 C11.2 24.55,4.87 22.61,2.92 | 22.61,2.92 v48.13,2.92 | 22.61,2.92 v6.86,2.92
  Bottom 0.152: v6.86,2.92 6.25,3.53 6.25,31.73 4.95,33.02 JP10.1 | JP9.1 56.01,33.02 52.73,29.74 52.73,7.52 v48.13,2.92
-2V5  (via drill 0.35)
  Top 0.152: U1.5 13.25,9.79 C8.2 13.25,12.32 15.11,14.19 LED-2.5.C 13.75,15.08 v13.46,15.37 | v30.48,37.72 30.23,37.47 ICH.4 | v14.99,42.93 15.24,43.18 IC7.11 | v30.48,69.85 29.84,70.48 IC3.4 v25.91,70.48 | ICPOW.6 41.62,74.64 v41.53,74.55 41.53,74.93 41.88,75.28 ICPOW.7 | ICSW.5 37.88,78.99 36.83,78.99 36.45,78.61 v36.45,78.49 | v36.45,80.52 36.94,81.01 ICSW.1 | ICA.4 29.84,64.14 v30.48,63.5 | ICG.4 30.1,41.27 v30.48,40.89 | ICF.4 29.96,45.09 30.48,44.58 v30.48,44.45 | ICE.4 29.96,48.9 v30.48,48.39 | ICD.4 29.96,52.71 v30.48,52.2 | ICC.4 30.09,56.52 v30.48,56.13 | ICB.4 29.97,60.33 30.48,59.82 v30.48,59.69 | v14.99,59.69 IC6.11
  Bottom 0.152: v41.53,74.55 41.53,73.41 39.24,71.12 35.81,71.12 | v36.45,80.52 v36.45,78.49 36.45,71.75 35.81,71.12 | v30.48,37.72 v30.48,40.89 v30.48,44.45 v30.48,48.39 v30.48,52.2 v30.48,56.13 v30.48,59.69 v30.48,63.5 v30.48,69.85 31.75,71.12 35.81,71.12 | v13.46,15.37 10.92,17.91 10.92,26.67 14.99,30.73 v14.99,42.93 v14.99,59.69 14.99,68.58 16.89,70.48 v25.91,70.48
-5V  (via drill 0.35)
  Top 0.152: v22.35,4.45 21.84,4.95 C9.2 | v26.67,4.32 v50.8,4.32 | C9.2 14.69,4.28 14.1,3.68 6.35,3.68 5.08,4.95 v5.08,6.35 | U1.2 14.22,6.35 14.67,5.91 | C9.2 14.69,5.88 14.67,5.91 | U1.3 15.17,6.41 14.67,5.91
  Bottom 0.152: v22.35,4.45 26.54,4.45 v26.67,4.32 | JP9.3 56.26,27.94 54.61,26.29 54.61,6.35 52.58,4.32 v50.8,4.32 | JP10.3 3.81,27.94 5.08,26.67 v5.08,6.35
AQA
  Top 0.152: ICA.2 26.55,65.14 24.38,67.31 13.68,67.31 12.91,66.55 R12.1 13.08,65.24 13.08,61.85 12.83,61.59 11.9,61.59 IC6.1
AQB
  Top 0.152: ICB.2 23.38,61.33 22.61,62.1 22.61,66.04 21.72,66.93 16.8,66.93 16.3,66.42 R24.1 16.3,61.94 16.59,61.64 IC6.14
AQC
  Top 0.152: ICC.2 23.74,57.52 22.86,56.64 22.86,53.47 22.23,52.83 16.89,52.83 16.3,53.43 R20.1 16.13,54.27 16.13,57.66 16.21,57.74 IC6.8
AQD
  Top 0.152: ICD.2 24.51,53.72 22.86,52.07 13.93,52.07 12.79,53.21 R16.1 12.95,54.27 12.95,57.53 12.74,57.74 IC6.7
AQE
  Top 0.152: ICE.2 27.44,49.9 26.29,51.05 14.35,51.05 13.08,49.78 13.08,48.93 R28.1 13.21,48.48 13.21,45.47 12.83,45.09 11.78,45.09 IC7.1
AQF
  Top 0.152: ICF.2 24.52,46.09 23.11,47.5 23.11,48.9 21.72,50.29 16.8,50.29 16.3,49.78 R40.1 16.3,45.3 16.46,45.13 IC7.14
AQG
  Top 0.152: ICG.2 24.5,42.28 23.37,41.15 23.37,37.97 21.84,36.45 16.51,36.45 16.38,36.58 16.38,37.5 R36.1 16.13,37.76 16.13,40.89 16.38,41.15 16.46,41.23 IC7.8
AQH
  Top 0.152: ICH.2 24.38,38.47 23.37,37.47 23.37,36.58 22.35,35.56 13.46,35.56 12.95,36.07 12.95,37.55 R32.1 12.91,41.06 12.7,41.27 11.78,41.27 IC7.7
BOOT0
  Top 0.152: R51.2 35.15,17.78 U$1.60
BOOT1  (via drill 0.35)
  Top 0.152: U$1.28 31.65,30.58 v31.88,30.35 | v38.23,32 R52.2
  Bottom 0.152: v31.88,30.35 37.08,30.35 38.1,31.37 38.1,31.88 v38.23,32
CS_CS
  Top 0.152: IC5.12 47.62,48.9 48.26,48.26 48.26,44.7 47.5,43.94 46.48,43.94 35.65,33.11 U$1.20
CSA
  Top 0.152: IC5.15 44.2,52.7 42.7,54.2 42.7,55.77 35.23,63.24 32.36,63.24 32,63.59 32,65.28 32.37,65.64 ICA.10
CSB
  Top 0.152: ICB.10 32.22,61.83 31.98,61.59 31.98,59.59 32.77,58.8 36.45,58.8 37.85,57.4 37.85,54.61 38.48,53.98 IC5.1
CSC
  Top 0.152: IC5.2 38.73,52.7 36.32,55.12 32.51,55.12 31.98,55.65 31.98,57.76 32.24,58.02 ICC.10
CSD
  Top 0.152: ICD.10 32.24,54.21 32,53.98 32,52.07 32.27,51.81 33.59,51.81 33.6,51.82 37.85,51.82 38.23,51.44 IC5.3
CSE
  Top 0.152: ICE.10 33.77,50.4 34.67,51.31 37.21,51.31 38.35,50.16 IC5.4
CSF
  Top 0.152: IC5.5 38.61,48.9 37.08,47.37 34.42,47.37 33.66,46.61 32.99,46.61 ICF.10
CSG
  Top 0.152: IC5.6 38.48,47.62 37.79,46.94 37.79,45.37 36.37,43.94 32.38,43.94 32.11,43.66 32.11,42.93 32.25,42.78 ICG.10
CSH
  Top 0.152: ICH.10 32.15,38.97 32.13,38.99 32.13,39.37 33.14,40.38 37.58,40.38 38.35,41.15 38.35,45.97 38.73,46.35 IC5.7
CSPOW  (via drill 0.35)
  Top 0.152: ICPOW.14 39.08,72.69 42.42,69.34 v42.67,69.34 | v47.5,69.34 49.28,67.56 49.28,44.36 43.1,38.19 43.1,31.92 40.34,29.16 U$1.15
  Bottom 0.152: v42.67,69.34 v47.5,69.34
GND  (via drill 0.35)
  other vias: 14.1,63.75 26.42,62.23 13.34,58.55 20.83,59.94 26.54,54.61 17.4,56.26 17.27,63.25 17.27,46.74 15.88,44.32 17.27,39.88 13.46,41.78 21.97,43.18 23.24,50.16 26.29,58.42 26.42,39.24 29.72,36.07 29.08,62.74 33.78,62.48 29.34,55.12 29.46,51.18 29.46,47.5 29.46,43.69 29.59,39.88 34.29,26.67 39.37,16.51 36.83,12.7 36.83,26.67 36.2,28.83 42.42,38.61 36.83,14.99 32.89,12.83 29.84,10.67 30.86,17.65 33.78,21.84 15.88,58.67
  pour Top: -1.27,-2.54 -1.27,104.14 115.57,104.14 115.57,-2.54
  pour Bottom: -2.54,-2.54 -2.54,103.12 119.38,103.12 119.38,-2.54
LVLA
  Top 0.152: ICPOW.10 38.33,75.28 39.12,76.07 39.12,80.26 38.87,80.51 ICSW.2
LVLB
  Top 0.152: ICPOW.8 41.29,75.94 40.77,76.45 40.77,79.63 41.15,80.01 ICSW.8
LVLW
  Top 0.152: IC3.6 34.42,71.75 34.92,72.26 34.92,75.31 35.56,75.95 ICPOW.9
MISO  (via drill 0.35)
  Top 0.152: v36.83,38.1 36.2,37.47 34.67,37.47 | 36.19,64.14 ICA.7 | ICG.7 36.08,41.28 v36.83,42.04 | ICC.7 36.46,56.52 v36.83,56.9 | ICD.7 36.2,52.71 v36.83,53.34 | ICE.7 36.2,48.9 v36.83,49.53 | ICF.7 36.33,45.09 v36.83,45.59 | ICB.7 36.46,60.33 v36.83,60.71 | ICPOW.4 44.52,73.33 45.09,72.77 45.09,66.17 42.42,63.5 v36.83,63.5 | ICH.7 34.67,37.47 | U$1.22 34.65,37.45 34.67,37.47 | v36.83,63.5 36.19,64.14 | 36.19,64.14 | v36.83,63.5
  Bottom 0.152: v36.83,38.1 v36.83,42.04 v36.83,45.59 v36.83,49.53 v36.83,53.34 v36.83,56.9 v36.83,60.71 v36.83,63.5
MOSI  (via drill 0.35)
  Top 0.152: ICH.8 35.18,37.97 v35.81,38.61 36.45,39.24 38.99,39.24 42.42,42.67 42.42,49.28 44.58,51.44 IC5.14 | ICG.8 35.43,41.78 v35.81,42.16 | ICC.8 33.07,57.12 35.57,57.12 35.81,57.36 v35.81,57.4 | ICD.8 35.31,53.21 v35.81,53.72 | ICE.8 35.31,49.4 v35.81,49.91 | ICF.8 35.31,45.59 v35.81,46.1 | v33.99,36.2 34.15,36.04 U$1.23 | v35.81,61.21 35.43,60.83 ICB.8 | ICPOW.3 44.16,72.69 44.7,72.14 44.7,67.06 42.55,64.9 v35.81,64.9 35.56,64.64 ICA.8
  Bottom 0.152: v35.81,64.9 v35.81,61.21 v35.81,57.4 v35.81,53.72 v35.81,49.91 v35.81,46.1 v35.81,42.16 v35.81,38.61 35.81,36.91 36.07,36.66 36.07,35.94 35.69,35.56 34.63,35.56 v33.99,36.2
N$1
  Top 0.152: U1.4 15.17,8.96 15.33,8.8 C10.2
N$2
  Top 0.152: 25.62,74.64 25.97,74.3 IC3.1 29.21,74.3 29.97,73.53 29.97,72.14 31.62,70.48 IC3.5 | 25.62,74.64 25.37,74.9 24.79,74.9 24.06,74.17 R3.2 | 25.62,74.64 R2.2
N$3
  Top 0.152: C2.2 28.73,59.82 ICB.5
N$4
  Top 0.152: LED-2.5.A 13.26,17.18 R4.2
N$5
  Top 0.152: C1.2 28.73,36.96 ICH.5
N$6
  Top 0.152: IC3.2 25.53,73.03 R2.1 24.8,72.14 23.68,72.14 R1.2
N$7
  Top 0.152: LED+2.5.C R5.2
N$8
  Top 0.152: C3.2 28.73,56.01 ICC.5
N$9
  Top 0.152: BIPOUT+.C R6.2
N$10
  Top 0.152: BIPOUT-.A R7.2
N$11
  Top 0.152: ICD.5 26.87,52.21 C4.2
N$12
  Top 0.152: LEDOUT.C R8.2
N$13
  Top 0.152: C14.2 28.73,63.63 ICA.5
N$14
  Top 0.152: ICE.5 27.03,48.4 C5.2
N$15
  Top 0.152: R10.1 R11.1 9.87,60.71 10.25,60.33 10.26,60.34 IC6.3
N$16
  Top 0.152: R13.1 R16.2 11.05,54.14 11.05,58.29 11.15,58.39 IC6.6
N$17
  Top 0.152: ICF.5 26.9,44.59 C6.2
N$18
  Top 0.152: R18.1 R19.1 18.45,59.05 17.62,59.05 IC6.10
N$19  (1 unrouted)
  Top 0.152: IC6.9 18.32,58.39 18.41,58.29 18.41,55.37 18,54.95 R20.2
N$20
  Top 0.152: ICG.5 26.9,40.78 C7.2
N$21
  Top 0.152: R9.1 9.99,65.53 11.43,65.53 11.43,65.41 R12.2 11.05,65.24 11.05,61.21 11.27,60.99 IC6.2
N$22
  Top 0.152: R22.1 R23.1 19.34,60.74 18.92,60.33 18.91,60.34 IC6.12
N$23
  Top 0.152: 18.29,65.11 R24.2 | R24.2 R21.1 | R24.2 18.41,64.98 18.41,61.21 18.19,60.99 IC6.13
N$24
  Top 0.152: R26.1 R27.1 9.87,44.32 10.38,43.81 11.71,43.81 IC7.3
N$25
  Top 0.152: R38.1 R39.1 19.34,44.23 18.92,43.81 17.5,43.81 IC7.12
N$26
  Top 0.152: R14.1 R15.1 9.74,58.55 10.25,59.05 10.26,59.04 IC6.5
N$28
  Top 0.152: R29.1 10.92,37.59 | 10.92,37.59 R32.2 | 10.92,37.59 10.92,41.66 11.15,41.88 IC7.6
N$29
  Top 0.152: R34.1 R35.1 19.34,42.12 19.3,42.16 18.92,42.55 17.5,42.55 IC7.10
N$30
  Top 0.152: R33.1 R36.2 18.29,37.88 18.29,41.66 18.03,41.91 17.51,41.91 IC7.9
N$31
  Top 0.152: BOOT0.2 32.38,17.74 R51.1
N$32
  Top 0.152: R37.1 R40.2 18.29,48.48 18.29,44.7 18.06,44.48 IC7.13
N$33
  Top 0.152: R30.1 R31.1 9.87,42.04 10.38,42.55 11.71,42.55 IC7.5
N$34
  Top 0.152: UTXL2.C 54.1,28.87 R43.2
N$35
  Top 0.152: URXL2.C 54.11,17.97 53.53,17.53 R44.2
N$36
  Top 0.152: C21.2 21.4,19.32 P47.3
N$38
  Top 0.152: C18.2 18.73,34.47 P31.3
N$41
  Top 0.152: R41.2 URXL1.C
N$42
  Top 0.152: UTXL1.C R42.2
N$43  (1 unrouted)
  Top 0.152: 11.3,44.45 10.92,44.83 10.92,48.48 R28.2 R25.1
N$47
  Top 0.152: PC0.C R47.2
N$48
  Top 0.152: PC1.C R48.2
N$49
  Top 0.152: PC2.C R49.2
N$50
  Top 0.152: PC3.C R50.2
N$51
  Top 0.152: P46.3 13.02,22.53 C19.2
N$52
  Top 0.152: BOOT1.2 41.49,36.16 41.49,33.78 41.11,33.4 R52.1
N$55
  Top 0.152: C24.2 18.6,31.17 18.86,31.42 P30.3
N$56
  Top 0.152: U$1.11 39.94,27.16 43.14,30.35 45.34,30.35 45.97,30.99 PC3.A
N$57
  Top 0.152: U$1.10 39.95,26.66 43.26,29.97 47.5,29.97 48.77,31.24 PC2.A
N$58
  Top 0.152: U$1.9 39.95,26.16 43.36,29.57 49.53,29.57 51.44,31.47 PC1.A
N$59
  Top 0.152: U$1.8 39.96,25.66 43.51,29.21 51.69,29.21 54.23,31.75 PC0.A
NRST  (via drill 0.35)
  Top 0.152: JP11.1 30.48,9.02 35.43,13.97 SW1.2 41.48,16.07 41.92,16.51 C29.2 42.29,16.52 v42.29,17.78 | U$1.7 39.14,25.15 37.85,25.15 v37.72,25.02
  Bottom 0.152: v37.72,25.02 42.29,20.45 v42.29,17.78
O1
  Top 0.152: ICSW.9 42.02,80.42 41.05,80.42 40.39,79.75 40.39,72.64 41.65,71.39 ICPOW.1
O2  (via drill 0.35)
  Top 0.152: v35.31,79.38 36.61,79.38 37.24,80.01 ICSW.3 | ICPOW.16 36.06,71.39 35.69,71.75 v35.69,72.01
  Bottom 0.152: v35.69,72.01 35.31,72.39 v35.31,79.38
OUT
  Top 0.152: LEDOUT.A 29.08,83.82 29.84,83.06 | 29.84,83.06 29.84,81.28 | 29.84,81.28 29.84,80.52 29.34,80.01 IC4.2 | IC4.1 29.84,81.28 | 29.84,83.06 47.24,83.06 49.66,80.64 49.66,44.24 43.46,38.04 43.46,31.77 40.35,28.66 U$1.14
OUT_BIP
  Top 0.152: IC3.7 31.62,73.03 30.61,74.04 30.61,78.49 30.35,78.74 IC4.3 23.53,78.74 BIPOUT+.A BIPOUT-.C
P30
  Top 0.152: U$1.30 30.65,30.78 29.97,30.1 26.92,30.1 25.65,31.37 24.09,31.37 23.2,30.48 P30.2
P31
  Top 0.152: P31.2 24,33.53 27.07,30.46 29.82,30.46 30.15,30.78 U$1.31
P45  (via drill 0.35)
  Top 0.152: U$1.45 30.14,23.66 30.48,24 v30.48,24.38
  Bottom 0.152: SWDIO.1 30.66,24.56 v30.48,24.38
P46  (via drill 0.35)
  Top 0.152: P46.2 17.73,21.59 19.3,23.16 U$1.46 30.18,23.16 v30.53,22.81
  Bottom 0.152: SWDIO.3 30.66,22.68 v30.53,22.81
P47
  Top 0.152: P47.2 21.72,20.45 22.86,20.45 23.5,21.08 23.5,21.72 24.44,22.66 U$1.47
Q1  (via drill 0.35)
  Top 0.152: U$1.50 30.15,21.16 v30.1,21.21 | v17.65,23.5 16.78,23.5 4.97,35.31 4.97,64.27 6.1,65.41 R9.2
  Bottom 0.152: v30.1,21.21 30.1,22.1 28.7,23.5 v17.65,23.5
Q2
  Top 0.152: U$1.44 16.62,24.16 5.33,35.45 5.33,62.48 6.35,63.5 8.04,63.5 R10.2
Q3
  Top 0.152: R13.2 6.04,52.1 6.04,35.75 15.63,26.16 U$1.40
Q4
  Top 0.152: U$1.41 15.63,25.66 5.68,35.6 5.68,55.21 6.6,56.13 R14.2
Q5  (via drill 0.35)
  Top 0.152: R17.2 22.06,55.12 v22.2,55.12 | U$1.27 32.15,32.41 v31.28,33.28
  Bottom 0.152: v22.2,55.12 24.13,53.19 24.13,36.58 27.1,33.61 30.91,33.61 31.24,33.28 v31.28,33.28
Q6  (via drill 0.35)
  Top 0.152: R18.2 21.04,56.64 21.55,57.15 v22.23,57.15 | U$1.26 32.65,32.88 31.29,34.24 v31.24,34.24
  Bottom 0.152: v22.23,57.15 24.66,54.71 24.66,36.56 24.77,36.45 26.97,34.24 v31.24,34.24
Q7  (via drill 0.35)
  Top 0.152: R21.2 21.59,65.41 21.95,65.05 v21.95,64.39 | v32.77,35.31 33.65,34.42 U$1.24
  Bottom 0.152: v21.95,64.39 25.4,60.94 25.4,36.83 26.92,35.31 v32.77,35.31
Q8  (via drill 0.35)
  Top 0.152: R22.2 21.59,63.37 21.95,63.02 v21.95,62.36 | v32.19,34.52 33.15,33.56 U$1.25
  Bottom 0.152: v21.95,62.36 25.02,59.28 25.02,36.71 26.82,34.9 31.81,34.9 v32.19,34.52
Q9
  Top 0.152: R25.2 8.17,48.18 6.4,46.41 6.4,35.9 15.64,26.66 U$1.39
Q10
  Top 0.152: R26.2 6.75,45.32 6.75,36.05 15.64,27.16 U$1.38
Q11
  Top 0.152: R29.2 8.17,36.28 16.29,28.16 U$1.36
Q12
  Top 0.152: U$1.37 15.65,27.66 7.11,36.2 7.11,38.73 8,39.62 R30.2
Q13  (via drill 0.35)
  Top 0.152: R33.2 21.46,37.59 v22.23,38.35 | U$1.35 25.48,28.66 v24.72,29.42
  Bottom 0.152: v22.23,38.35 22.47,38.11 22.47,31.67 v24.72,29.42
Q14  (via drill 0.35)
  Top 0.152: R34.2 21.72,39.62 v22.23,40.13 | v24.36,30.71 25.92,29.16 U$1.34
  Bottom 0.152: v22.23,40.13 22.95,39.4 22.95,32.17 24.36,30.76 v24.36,30.71
Q15  (via drill 0.35)
  Top 0.152: R37.2 21.95,48.77 v22.33,48.39 | U$1.29 31.15,32.48 30.68,32.95 v29.46,32.95
  Bottom 0.152: v22.33,48.39 23.67,47.05 23.67,35.9 26.62,32.95 v29.46,32.95
Q16  (via drill 0.35)
  Top 0.152: R38.2 21.84,46.74 v22.35,46.23 | U$1.33 26.35,29.66 v25.4,30.61
  Bottom 0.152: v22.35,46.23 23.31,45.27 23.31,32.7 v25.4,30.61
RCC1
  Top 0.152: C26.1 51.11,25.72 X1.1 47.7,25.72 46.13,24.16 U$1.5
RCC2
  Top 0.152: U$1.6 40.53,24.66 41.78,25.91 41.78,26.67 42.4,27.29 C25.2 43.07,27.3 44.7,27.3 44.99,27.59 X1.3
RTC1
  Top 0.152: U$1.4 44.54,23.66 45.97,22.23 X2.2 48.37,22.23 C27.1
RTC2
  Top 0.152: X2.1 43.95,22.21 C28.2 42.28,22.35 41.66,22.35 40.85,23.16 U$1.3
SCLK  (via drill 0.35)
  Top 0.152: ICH.9 32.98,38.48 34.67,38.48 34.92,38.73 v34.92,39.12 | ICA.9 32.98,65.15 34.67,65.15 v34.92,65.41 35.56,66.04 42.67,66.04 44.35,67.71 44.35,71.52 43.83,72.03 ICPOW.2 | ICG.9 34.66,42.28 v34.92,42.55 | ICC.9 34.54,57.52 v34.92,57.91 | ICD.9 34.41,53.71 v34.92,54.23 | ICE.9 34.41,49.9 v34.92,50.42 | ICF.9 34.41,46.09 v34.92,46.61 | U$1.21 35.15,36.16 v35.31,36.32 35.34,36.35 36.6,36.35 42.77,42.52 42.77,45.54 44.86,47.62 IC5.11 | ICB.9 34.54,61.33 v34.92,61.72
  Bottom 0.152: v34.92,65.41 v34.92,61.72 v34.92,57.91 v34.92,54.23 v34.92,50.42 v34.92,46.61 v34.92,42.55 v34.92,39.12 34.92,36.71 v35.31,36.32
SWCLK  (via drill 0.35)
  Top 0.152: U$1.49 29.65,19.12 v29.84,18.92
  Bottom 0.152: JP11.2 33.02,9.65 29.72,12.95 29.72,18.8 v29.84,18.92
SWDIO
  Bottom 0.152: JP11.3 35.56,21.34 35.56,21.46 35.56,22.23 34.16,23.62 SWDIO.2
URX1  (via drill 0.35)
  Top 0.152: U$1.43 17.23,24.66 v16.89,25 | v12.7,25.4 7.4,25.4 URXL1.A 2.83,25.37 JP10.4
  Bottom 0.152: v16.89,25 13.1,25 v12.7,25.4
URX2  (via drill 0.35)
  Top 0.152: U$1.17 37.15,29.4 v37.21,29.34 | v50.8,23.62 51.78,22.64 URXL2.A 58.2,22.64 JP9.5
  Bottom 0.152: v37.21,29.34 42.93,23.62 v50.8,23.62
UTX1  (via drill 0.35)
  Top 0.152: U$1.42 28.94,25.16 v28.96,25.15 | JP10.5 7.21,22.86 UTXL1.A 8.8,23.02 9.91,24.13 v12.7,24.13
  Bottom 0.152: v28.96,25.15 17.97,25.15 17.16,24.34 12.91,24.34 v12.7,24.13
UTX2  (via drill 0.35)
  Top 0.152: U$1.16 38.41,29.66 v37.97,30.1 | v52.07,24.26 52.1,24.22 53.98,24.22 UTXL2.A 57.37,24.35 JP9.4
  Bottom 0.152: v37.97,30.1 37.97,29.08 42.55,24.51 51.82,24.51 v52.07,24.26
W
  Top 0.152: ICH.3 29.72,37.97 31.62,39.88 31.62,41.78 | 31.62,41.78 31.62,45.59 | 31.62,45.59 31.62,49.4 | 31.62,49.4 31.62,53.21 | 31.62,53.21 31.62,57.02 | 31.62,57.02 31.62,60.83 | 31.62,60.83 31.62,63.37 | 31.62,63.37 30.35,64.64 ICA.3 | ICG.3 31.62,41.78 | ICF.3 31.62,45.59 | ICE.3 31.62,49.4 | ICD.3 31.62,53.21 | ICC.3 31.62,57.02 | ICB.3 31.62,60.83 | 31.62,63.37 31.62,69.98 29.85,71.75 IC3.3 25.4,71.75 24.77,71.12 24.77,69.98 24.38,69.6 C13.1 22.86,69.6 22.61,69.85 22.61,73.79 22.23,74.17 R3.1

### Text on the board
tNames: +3 | +3 | -3
bNames: P45 | P46